# Altium schematic sheet Schematic.schdoc
size 166 x 108 mm
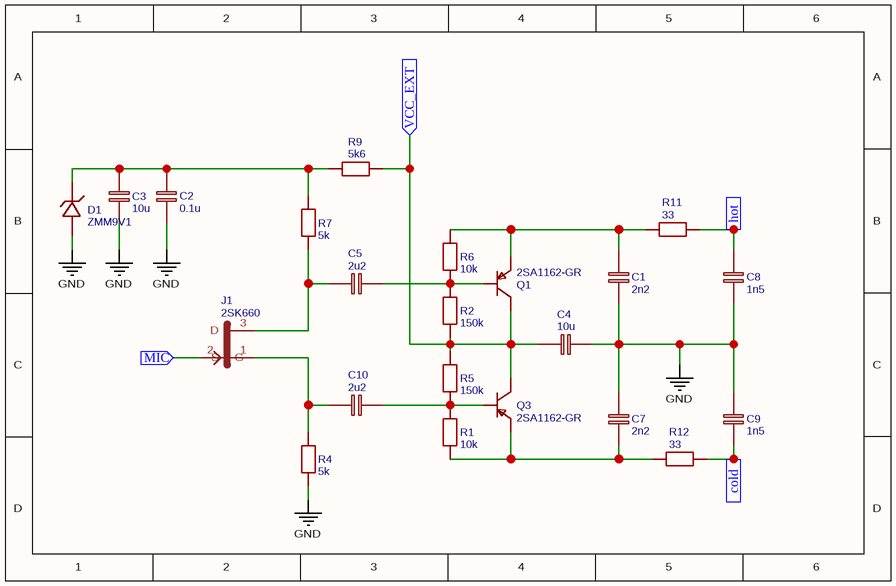
[diagram p0: Schematic.schdoc]

## Parts
C1  2n2  [C0603]
C2  0.1u  [C0603]
C3  10u  [C1206]
C4  10u  [C1206]
C5  2u2  [C0603]
C7  2n2  [C0603]
C8  1n5  [C0603]
C9  1n5  [C0603]
C10  2u2  [C0603]
D1  ZMM9V1  [LL-34_L3.5-W1.5-RD]
J1  2SK660  [TO92-3L_L4.0-W1.5-P1.27]
Q1  2SA1162-GR  [SOT-23-3_L2.9-W1.6-P1.90-LS2.8-BR]
Q3  2SA1162-GR  [SOT-23-3_L2.9-W1.6-P1.90-LS2.8-BR]
R1  10k  [R0603]
R2  150k  [R0603]
R4  5k  [R0603]
R5  150k  [R0603]
R6  10k  [R0603]
R7  5k  [R0603]
R9  5k6  [R0603]
R11  33  [R0603]
R12  33  [R0603]

## Ports
cold (in), hot (in), MIC (in), VCC_EXT (in)

## Nets
GND: C1.1 C2.1 C3.1 C4.1 C7.2 C8.1 C9.2 D1.2(A) R4.2
cold: C9.1 R12.2 ; port cold
hot: C8.2 R11.2 ; port hot
MIC: J1.2(G) ; port MIC
VCC_EXT: C4.2 Q1.3 Q3.3 R2.2 R5.1 R9.1 ; port VCC_EXT
NetC1_2: C1.2 Q1.2 R6.1 R11.1
NetC2_2: C2.2 C3.2 D1.1(C) R7.1 R9.2
NetC5_1: C5.1 Q1.1 R2.1 R6.2
NetC5_2: C5.2 J1.3(D) R7.2
NetC7_1: C7.1 Q3.2 R1.2 R12.1
NetC10_1: C10.1 Q3.1 R1.1 R5.2
NetC10_2: C10.2 J1.1(S) R4.1

## Library data of the parts
C1 C7 = 2n2: Manufacturer Part: 0603B222K500NT; Manufacturer: FH(风华); nameAlias: Value(F); Contributor: LCEDA_Lib; Supplier Part: C1604; Supplier: LCSC; spicePre: C; spiceSymbolName: C_0603_EU
C2 = 0.1u: Manufacturer Part: CC0603KRX7R9BB104; Manufacturer: YAGEO(国巨); nameAlias: Value(F); Contributor: LCEDA_Lib; Package Display: No; Supplier Part: C14663; Supplier: LCSC; spicePre: C; spiceSymbolName: C_0603_EU
C3 C4 = 10u: Manufacturer Part: CL31A106KBHNNNE; Manufacturer: SAMSUNG(三星); nameAlias: Value(F); Contributor: LCEDA_Lib; Supplier Part: C13585; Supplier: LCSC; spicePre: C; spiceSymbolName: C_0201_EU
C5 C10 = 2u2: Manufacturer Part: CL10A225KO8NNNC; Manufacturer: SAMSUNG(三星); nameAlias: Value(F); Contributor: LCEDA_Lib; Supplier Part: C23630; Supplier: LCSC; spicePre: C; spiceSymbolName: C_0201_EU
C8 C9 = 1n5: Manufacturer Part: CL10B152KB8NNNC; Manufacturer: SAMSUNG(三星); nameAlias: Value(F); Contributor: LCEDA_Lib; Supplier Part: C37788; Supplier: LCSC; spicePre: C; spiceSymbolName: C_0603_EU
D1 = ZMM9V1: Manufacturer: YONGYUTAI(永裕泰); Supplier: LCSC; Manufacturer Part: ZMM9V1; Supplier Part: C2891750; JLCPCB Part Class: Extended Part; spicePre: D; spiceSymbolName: ZMM9V1
J1 = 2SK660: Contributor: rayindra.panandita; spicePre: J; spiceSymbolName: 2SK660
Q1 Q3 = 2SA1162-GR: Manufacturer: CJ(江苏长电/长晶); Manufacturer Part: 2SA1162(RANGE:200-400); Supplier: LCSC; Supplier Part: C8536; spicePre: Q; spiceSymbolName: 2SA1162-GR
R1 R6 = 10k: Manufacturer Part: 0603WAF1002T5E; Manufacturer: UNI-ROYAL(厚声); nameAlias: Value(Ω); Contributor: LCEDA_Lib; Supplier Part: C25804; Supplier: LCSC; spicePre: R; spiceSymbolName: R_0603_EU
R2 R5 = 150k: Manufacturer Part: 0603WAF1503T5E; Manufacturer: UNI-ROYAL(厚声); nameAlias: Value(Ω); Contributor: LCEDA_Lib; Supplier Part: C22807; Supplier: LCSC; spicePre: R; spiceSymbolName: R_0603_EU
R4 R7 = 5k: Manufacturer Part: 0603WAF5601T5E; Manufacturer: UNI-ROYAL(厚声); nameAlias: Value(Ω); Contributor: LCEDA_Lib; Supplier Part: C23189; Supplier: LCSC; spicePre: R; spiceSymbolName: R_0603_EU
R9 = 5k6: Manufacturer Part: 0603WAF5601T5E; Manufacturer: UNI-ROYAL(厚声); nameAlias: Value(Ω); Contributor: LCEDA_Lib; Supplier Part: C23189; Supplier: LCSC; spicePre: R; spiceSymbolName: R_0603_EU
R11 R12 = 33: Manufacturer Part: 0603WAF3303T5E; Manufacturer: UNI-ROYAL(厚声); nameAlias: Value(Ω); Contributor: LCEDA_Lib; Supplier Part: C23137; Supplier: LCSC; spicePre: R; spiceSymbolName: R_0603_EU